# Altium schematic sheet drveth.SchDoc: JKA 2.0 原理图
size A4; Author: JACK; CompanyName: 北京康洁之晨水处理技术有限公司; DrawnBy: 郭相炳; Organization: 北京康洁; DocumentNumber: 6; Revision: 2.0; SheetNumber: 6; SheetTotal: 6; ImagePath: E:\JKAdoc\data\LOGO.jpg; ProjectName: JKA2.0
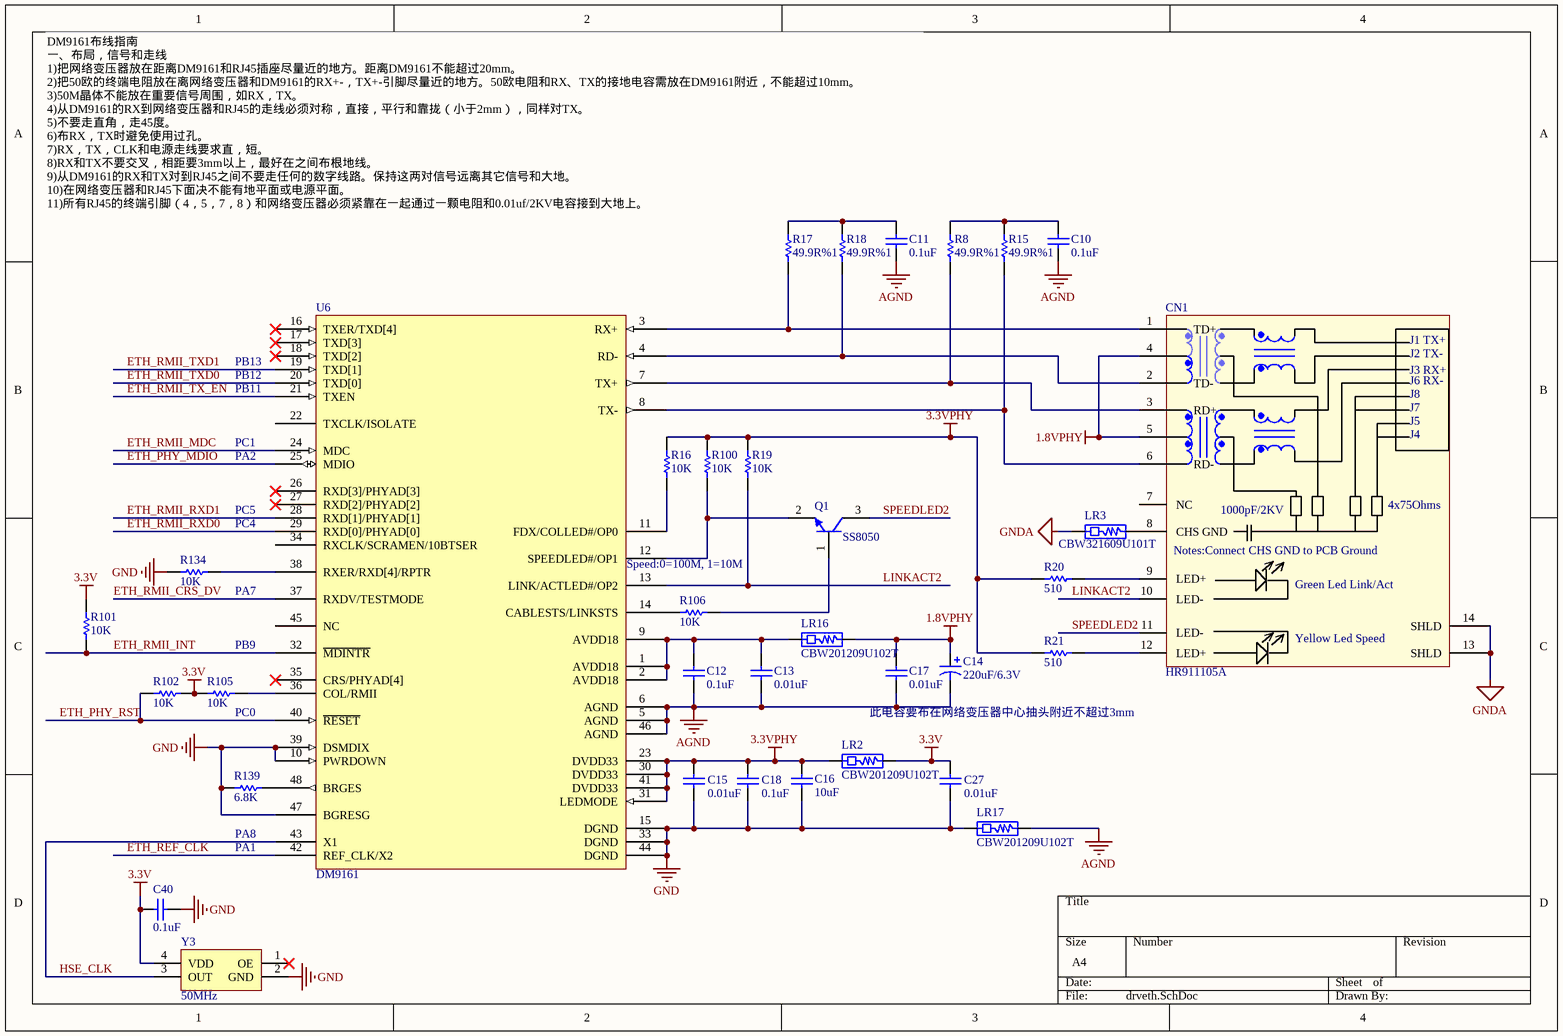
[diagram p0: drveth.SchDoc]

## Parts
C10  0.1uF  [CAPC2012M]
C11  0.1uF  [CAPC2012M]
C12  0.1uF  [CAPC2012M]
C13  0.01uF  [CAPC2012M]
C14  220uF/6.3V  [CAPC3528MS]
C15  0.01uF  [CAPC2012M]
C16  10uF  [CAPC2012M]
C17  0.01uF  [CAPC2012M]
C18  0.1uF  [CAPC2012M]
C27  0.01uF  [CAPC2012M]
C40  0.1uF  [CAPC2012M]
CN1  HR911105A  [HR911105A(RJ-45)]
LR2  CBW201209U102T  [INDC2012M]
LR3  CBW321609U101T  [INDC3216M]
LR16  CBW201209U102T  [INDC2012M]
LR17  CBW201209U102T  [INDC2012M]
Q1  SS8050  [SOT-23_N]
R8  49.9R%1  [RESC2012M]
R15  49.9R%1  [RESC2012M]
R16  10K  [RESC2012M]
R17  49.9R%1  [RESC2012M]
R18  49.9R%1  [RESC2012M]
R19  10K  [RESC2012M]
R20  510  [RESC2012M]
R21  510  [RESC2012M]
R100  10K  [RESC2012M]
R101  10K  [RESC2012M]
R102  10K  [RESC2012M]
R105  10K  [RESC2012M]
R106  10K  [RESC2012M]
R134  10K  [RESC2012M]
R139  6.8K  [RESC2012M]
U6  DM9161  [LQFP48_L]
Y3  value 50MHz  [X-CP3225]  (hidden comment: XATLS)

## Nets
1.8VPHY: C14.1 C17.1 CN1.4 CN1.5 LR16.1
3.3V: C27.1 C40.1 LR2.1 R101.1 R102.2 R105.1 Y3.4(VDD)
3.3VPHY: C15.1 C16.1 C18.1 LR2.2 R16.1 R19.1 R20.1 R21.1 R100.1 U6.23(DVDD33) U6.30(DVDD33) U6.31(LEDMODE) U6.41(DVDD33)
AGND: C10.2 C11.2 C12.2 C13.2 C14.2 C17.2 LR17.1 U6.5(AGND) U6.6(AGND) U6.46(AGND)
GND: C15.2 C16.2 C18.2 C27.2 C40.2 LR17.2 R134.1 R139.1 U6.10(PWRDOWN) U6.15(DGND) U6.33(DGND) U6.39(DSMDIX) U6.44(DGND) U6.47(BGRESG) Y3.2(GND)
GNDA: CN1.13(SHLD) CN1.14(SHLD) LR3.2
ETH_PHY_MDIO: U6.25(MDIO)
ETH_PHY_RST: R102.1 U6.40(~{RESET})
ETH_REF_CLK: U6.42(REF_CLK/X2)
ETH_RMII_CRS_DV: U6.37(RXDV/TESTMODE)
ETH_RMII_INT: R101.2 U6.32(~{MDINTR})
ETH_RMII_MDC: U6.24(MDC)
ETH_RMII_RXD0: U6.29(RXD[0]/PHYAD[0])
ETH_RMII_RXD1: U6.28(RXD[1]/PHYAD[1])
ETH_RMII_TX_EN: U6.21(TXEN)
ETH_RMII_TXD0: U6.20(TXD[0])
ETH_RMII_TXD1: U6.19(TXD[1])
HSE_CLK: U6.43(X1) Y3.3(OUT)
LINKACT2: CN1.10(LED-) R19.2 U6.13(LINK/ACTLED#/OP2)
SPEEDLED2: CN1.11(LED-) Q1.3(C)
NetC10_1: C10.1 R8.1 R15.1
NetC11_1: C11.1 R17.1 R18.1
NetC12_1: C12.1 C13.1 LR16.2 U6.1(AVDD18) U6.2(AVDD18) U6.9(AVDD18)
NetCN1_1: CN1.1(TD+) R17.2 U6.3(RX+)
NetCN1_2: CN1.2(TD-) R18.2 U6.4(RD-)
NetCN1_3: CN1.3(RD+) R8.2 U6.7(TX+)
NetCN1_6: CN1.6(RD-) R15.2 U6.8(TX-)
NetCN1_8: CN1.8(CHS_GND) LR3.1
NetCN1_9: CN1.9(LED+) R20.2
NetCN1_12: CN1.12(LED+) R21.2
NetQ1_1: Q1.1(B) R106.2
NetQ1_2: Q1.2(E) R100.2 U6.12(SPEEDLED#/OP1)
NetR16_2: R16.2 U6.11(FDX/COLLED#/OP0)
NetR105_2: R105.2 U6.36(COL/RMII)
NetR106_1: R106.1 U6.14(CABLESTS/LINKSTS)
NetR134_2: R134.2 U6.38(RXER/RXD[4]/RPTR)
NetR139_2: R139.2 U6.48(BRGES)

Not connected (* = marked no-connect by the designer): CN1 7(NC); U6 16(TXER/TXD[4])* 17(TXD[3])* 18(TXD[2])* 22(TXCLK/ISOLATE) 26(RXD[3]/PHYAD[3])* 27(RXD[2]/PHYAD[2])* 34(RXCLK/SCRAMEN/10BTSER) 35(CRS/PHYAD[4])* 45(NC); Y3 1(OE)*

## Notes on the sheet
- DM9161布线指南
  一、布局，信号和走线
  1)把网络变压器放在距离DM9161和RJ45插座尽量近的地方。距离DM9161不能超过20mm。
  2)把50欧的终端电阻放在离网络变压器和DM9161的RX+-，TX+-引脚尽量近的地方。50欧电阻和RX、TX的接地电容需放在DM9161附近，不能超过10mm。
  3)50M晶体不能放在重要信号周围，如RX，TX。
  4)从DM9161的RX到网络变压器和RJ45的走线必须对称，直接，平行和靠拢（小于2mm），同样对TX。
  5)不要走直角，走45度。
  6)布RX，TX时避免使用过孔。
  7)RX，TX，CLK和电源走线要求直，短。
  8)RX和TX不要交叉，相距要3mm以上，最好在之间布根地线。
  9)从DM9161的RX和TX对到RJ45之间不要走任何的数字线路。保持这两对信号远离其它信号和大地。
  10)在网络变压器和RJ45下面决不能有地平面或电源平面。
  11)所有RJ45的终端引脚（4，5，7，8）和网络变压器必须紧靠在一起通过一颗电阻和0.01uf/2KV电容接到大地上。
  12)   BANDGAP电阻必须布在尽量靠近47和48脚旁边（不超过3mm）。避免走任何高速信号在这个电阻附近（到晶振必须大于3mm）。
  二、供电，退耦电容
  1）退耦电容必须布在尽量靠近电源焊盘附近（不超过2.5mm），推荐容量为0.1或者0。01uf。
  2） 退藕电容必须足够，已保证以下效果：
  （1）所有的模拟VDD和数字VDD  的纹波小于50mVpp
  （2）所有的模拟地和数字地的纹波小于50mVpp
  （3）所有通过模拟数字的AC噪音要小于100mVpp
  3）保守的做法是每个引脚接两个退耦电容。0.1uf和0.01uf个一个。
  4） 这就是说在中心抽头AVDD和AGND之间必须布一个0.01uf的退耦电容。这个退耦电容必须布在网络变压器中心抽头附近，越近越好。
  三、地平面布线
  1）地平面分隔会增加EMI的排放量。
  2） 地平面需要分成模拟地和数字地，其之间连接的线必须远离DM9161的AGND脚。
  3） 所有的模拟地引脚不能直接（5，6，46）短接，必须直接连到模拟地平面上。
  4） 模拟地平面尽可能的大。
  四、电源层分隔
  1）使用的铁氧体磁珠，在100MHZ和200mA电流情况下，阻值大于100欧。铁氧体磁珠两边必须各放一个10uf，0.1uf和0.01uf的电容。
  2） 必须把模拟电源层和数字电源层隔离开。
  五、和Mac连接
  和mac连接的线必须短而直。
  TXD[0-3]何TXCLK的长度差异不能超过2cm
  RXD[0-3]何RXCLK的长度差异不能超过2cm
- PB12
- PB13
- PB11
- PC1
- PA2
- PC5
- PC4
- (near U6) Speed:0=100M, 1=10M
- (near R134) PA7
- PB9
- (near R105) PC0
- 此电容要布在网络变压器中心抽头附近不超过3mm
- PA1
- PA8
- (in symbol HR911105A) J1 TX+; J2 TX-; J3 RX+; J6 RX-; J8; J7; J5; J4; 4x75Ohms; 1000pF/2KV; Notes:Connect CHS GND to PCB Ground; Green Led Link/Act; Yellow Led Speed

## Library data of the parts
C10-C13 C15-C18 C27 C40 = Cap: Capacitor; Value: 1nF; Published: 8-Jun-2000; LatestRevisionDate: 17-Jul-2002; LatestRevisionNote: Re-released for DXP Platform.; PackageReference: RAD-0.3; Publisher: Altium Limited
C14 = Cap Pol1: Polarized Capacitor (Radial); Value: 100pF; Published: 8-Jun-2000; LatestRevisionDate: 17-Jul-2002; LatestRevisionNote: Re-released for DXP Platform.; PackageReference: RB7.6-15; Publisher: Altium Limited
LR2 LR3 LR16 LR17 = BLM10/11/21/31/41: EMI FILTERS,DC Resistance max.0.05~1.5 ohms,10 ~ 1000 ohms at 100MHz  Frequency
Q1 = PMMT491A: NPN BISS Transistor; Published: 17-Sep-2003; LatestRevisionDate: 12-Dec-2006; LatestRevisionNote: IPC-7351 Footprint Added.; DatasheetVersion: 11-Jun-2001; PackageVersion: May-1999; PackageReference: SOT23; Publisher: Altium Limited; PackageDescription: 3-Pin SOT-23 Package 0.95 mm Pitch, 2.3 mm Lead Span; ComponentLink1Description: Manufacturer Link; ComponentLink1URL: http://www.semiconductors.philips.com/; ComponentLink2Description: Datasheet; ComponentLink2URL: http://www.semiconductors.philips.com/acrobat/datasheets/PMMT491A_5.pdf
R8 R15 R17 R18 R20 R21 R139 = Res1: Resistor; Value: 10K; Published: 8-Jun-2000; LatestRevisionDate: 17-Jul-2002; LatestRevisionNote: Re-released for DXP Platform.; PackageReference: AXIAL-0.3; Publisher: Altium Limited
R16 R19 R100-R102 R105 R106 R134 = Res1: Resistor; Published: 8-Jun-2000; LatestRevisionDate: 17-Jul-2002; LatestRevisionNote: Re-released for DXP Platform.; PackageReference: AXIAL-0.3; Publisher: Altium Limited; Value: 10K
U6 = DM9161: 网络芯片
Y3 = XATLS: 贴片有源晶振